# Altium schematic sheet [3] ADC_INPUT_BIAS.SchDoc: ADC Input Bias
size 299 x 210 mm; SheetNumber: 3; SheetTotal: 21; PageSetup: Record=PageOptions|CenterHorizontal=True|CenterVertical=True|PrintScale=0.94|XCorrection=0.00|YCorrection=0.00|PrintKind=0|BorderSize=5000000|LeftOffset=0|BottomOffset=0|Orientation=2|PaperLength=1000|PaperWidth=1000|Scale=100|PaperSource=15|PrintQuality=600|MediaType=1|DitherType=10|PrintScaleMode=1|PaperKind=A4; Adr1: August Barks gata 6B; Adr2: SE-421 32 Västra Frölunda; Adr3: Sweden; Webpage: www.omnisys.se
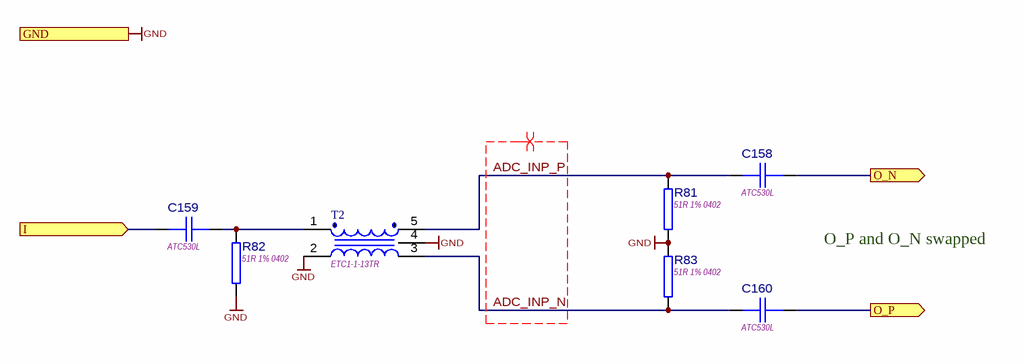
[diagram p0: [3] ADC_INPUT_BIAS.SchDoc]

## Parts
C158  ATC530L  [CAPC1005X06L]
C159  ATC530L  [CAPC1005X06L]
C160  ATC530L  [CAPC1005X06L]
R81  51R 1% 0402  [RESC1005L]
R82  51R 1% 0402  [RESC1005L]
R83  51R 1% 0402  [RESC1005L]
T2  ETC1-1-13TR  [SOTFL50P160X73-3N]

## Ports
GND, I (in), O_N (out), O_P (out)

## Nets
GND: R81.1 R82.2 R83.2 T2.2(Primary) T2.4(NC) ; port GND
ADC_INP_N: C160.2 R83.1 T2.3(Secondary)
ADC_INP_P: C158.2 R81.2 T2.5(Secondary_dot)
I: C159.2 ; port I
O_N: C158.1 ; port O_N
O_P: C160.1 ; port O_P
NetC159_1: C159.1 R82.1 T2.1(Primary_dot)

## Layout directives
differential pair; rule Differential Pairs Routing [Pref Gap = 0.2mm    Min Gap  = 0.2mm    Max Gap  = 0.2mmPref Width = 0.3mm    Min Width  = 0.3mm    Max Width  = 0.3mm]; net class DiffPairs_Input: ADC_INP_N, ADC_INP_P

## Notes on the sheet
- O_P and O_N swapped
- August Barks gata 6B
- Omnisys Instruments AB
- Title:
- PCB ASY:
- PCB:
- SVN:
- SVN Folder:
- SE-421 32 Västra Frölunda
- www.omnisys.se
- Page:
- of
- Print date:
- Page size:
- A4
- Information contained in this drawing is confidential. Copying, distributing or use in any matter, other than that specified by OMNISYS INSTRUMENTS AB, is strictly prohibited.

## Library data of the parts
C158-C160 = CMP-0300-000000-2: 100n 16V ±15% 0402 (1005 metric) ATC530L104KT16T; Case-EIA: 0402; Case-Metric: 1005; Dielectric: X7R; OmnisysBuy: False; Maximum working voltage: 16V; Tolerance: ±15%; Technology: SMT
R81-R83 = CMP-1800-001397-4: Thick film Chip Resistor, 0402/1005; Value: 51; Power: 100mW; Maximum working voltage: 50V; Temp. Coefficent: 0.01%; Tolerance: 1%; Case/Package: 0402/1005; Composition: Thick film
T2 = CMP-2000-000004-1: Transformers Audio & Signal 4.5-3000MHz IL 2dB Impedance Ratio 1:1; Max DC Current: 30mA; Power Rating: 250mW; Case/Package: SMD/SMT; Package Quantity: 2000; Termination: SMD/SMT; Depth: 3.81mm; Max Operating Temperature: 85°C; Turns Ratio: 1:1; Length: 3.81mm; Width: 3.81mm; Radiation Hardening: No; Packaging: Tape and Reel; Min Operating Temperature: -40°C; Mount: Surface Mount; Number of Pins: 5; Height: 2.67mm; Lead Free: Contains Lead